# Altium schematic sheet Nam_Sheet2.SchDoc
size A4; Organization: Altium Limited; Address1: L3, 12a Rodborough Rd; Address2: Frenchs Forest; Address3: NSW; Address4: Australia 2086
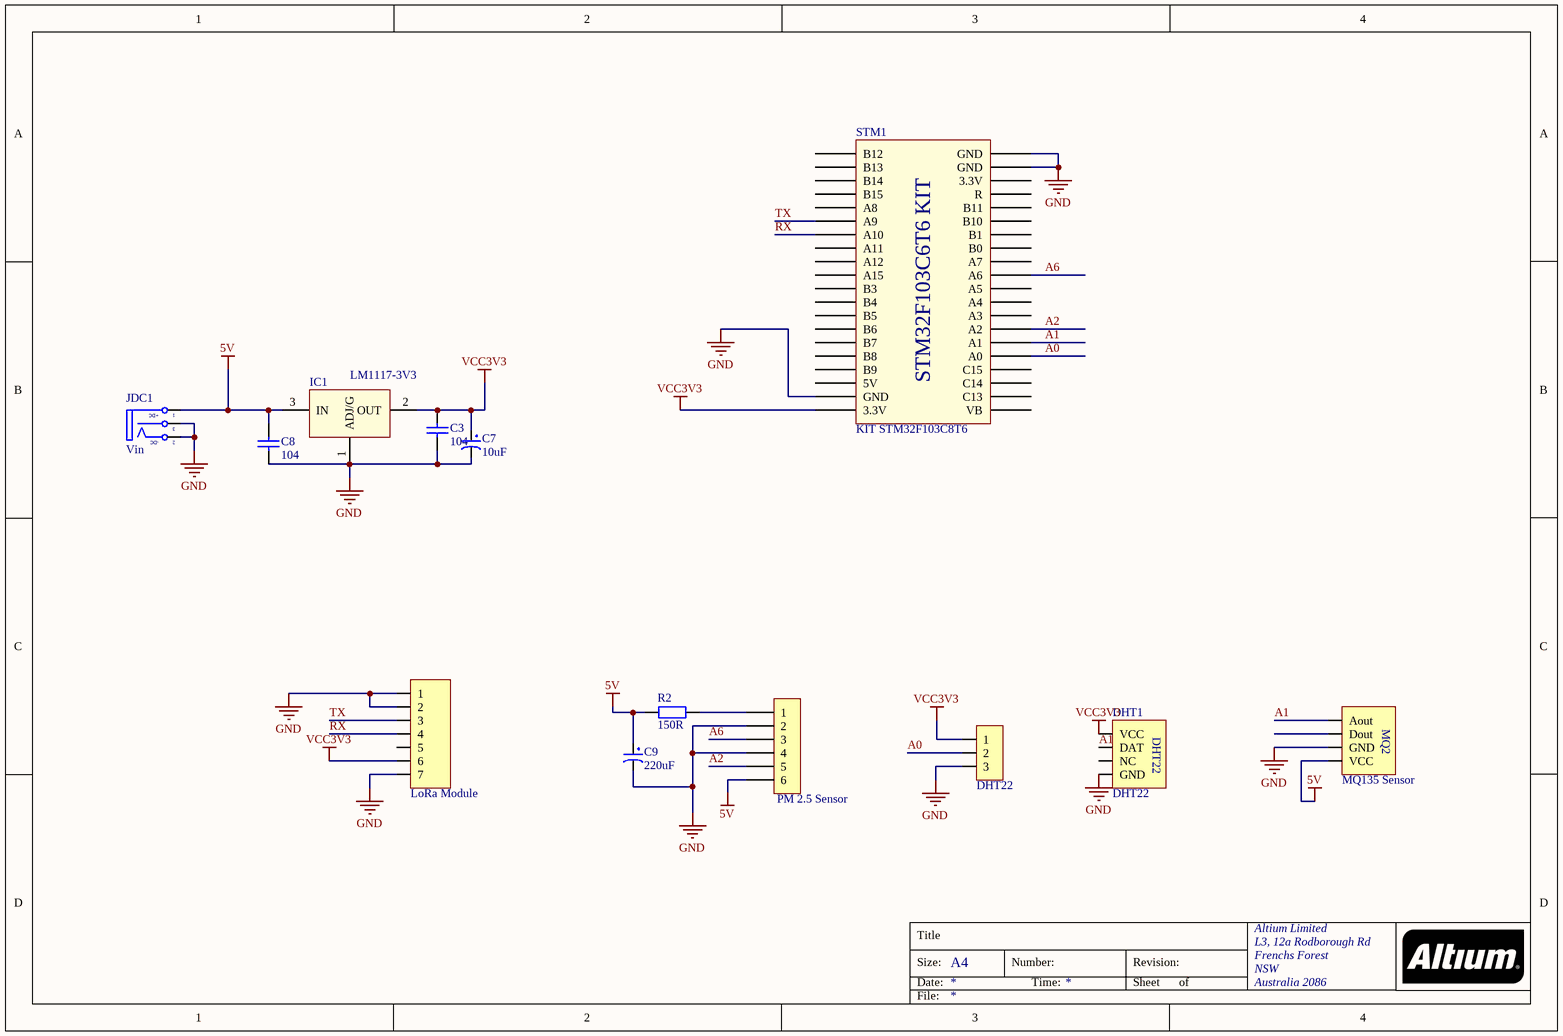
[diagram p0: Nam_Sheet2.SchDoc]

## Parts
C3  104  [tu gom]
C7  10uF  [Tu hoa 8mm]
C8  104  [tu gom]
C9  220uF  [Tu hoa 8mm]
DHT1  DHT22  [DHT22]
DHT22  DHT22  [JP 1x3 CT]
H2  PM 2.5 Sensor  [XH2.54M-6]
IC1  LM1117-3V3  [SOT223-4N]
JDC1  Vin  [DC-IN]
LoRa_Module  LoRa Module  [JP 1x7 CT]
MQ135_Sensor  MQ135 Sensor  [MQ2-MODULE]
R2  150R  [tro vach 1/4w]
STM1  KIT STM32F103C8T6  [STM32F103 KIT]

## Nets
5V: C8.2 C9.1 H2.6 IC1.3(IN) JDC1.1(T) MQ135_Sensor.4(VCC) R2.1
GND: C3.1 C7.2 C8.1 C9.2 DHT1.4(GND) DHT22.3 H2.2 H2.4 IC1.1(ADJ/G) JDC1.2(TN) JDC1.3(S) LoRa_Module.1 LoRa_Module.2 LoRa_Module.7 MQ135_Sensor.3(GND) STM1.19(GND) STM1.39(GND) STM1.40(GND)
VCC3V3: C3.2 C7.1 DHT1.1(VCC) DHT22.1 IC1.2(OUT) LoRa_Module.6 STM1.20(3.3V)
A0: DHT22.2 STM1.25(A0)
A1: DHT1.2(DAT) MQ135_Sensor.1(Aout) STM1.26(A1)
A2: H2.5 STM1.27(A2)
A6: H2.3 STM1.31(A6)
RX: LoRa_Module.4 STM1.7(A10)
TX: LoRa_Module.3 STM1.6(A9)
NetH2_1: H2.1 R2.2

Not connected (* = marked no-connect by the designer): DHT1 3(NC); LoRa_Module 5; MQ135_Sensor 2(Dout); STM1 1(B12) 2(B13) 3(B14) 4(B15) 5(A8) 8(A11) 9(A12) 10(A15) 11(B3) 12(B4) 13(B5) 14(B6) 15(B7) 16(B8) 17(B9) 18(5V) 21(VB) 22(C13) 23(C14) 24(C15) 28(A3) 29(A4) 30(A5) 32(A7) 33(B0) 34(B1) 35(B10) 36(B11) 37(R) 38(3.3V)

## Notes on the sheet
- Title
- Size:
- Date:
- A4
- Number:
- Time:
- Revision:
- Sheet
- of
- File:
- (in symbol DCIN) +DC; -DC
- (in symbol MQ2-MOD) MQ2
- (in symbol STM32f103 Bluepill) STM32F103C6T6 KIT

## Library data of the parts
C3 C8 = Tu gom 104 50V: Cắm; So_Chan: 2; Ten_Linh_Kien: Tụ gốm 104 100nF 50V; Don_Vi: Con; Ma_Hang: MH004761; Chung_Loai: Cắm; Kieu_Chan: *
C7 C9 = Tu Hoa 220uF 25V 8x10: Cắm; Don_Vi: Con; So_Chan: 2; Ten_Linh_Kien: Tụ Hóa 220uF 25V 8x10MM; Ma_Hang: MH006864; Chung_Loai: Cắm; Kieu_Chan: *
DHT1 = DHT22: Manufacturer: W¨¹rth Elektronik eiSos GmbH; partNo: 613004143121; ComponentLink1 Description: Manufacturer; ComponentLink2 Description: Datasheet; NoPins: 04; Created Date: 29 March 2013; ComponentLink1URL: http://www.we-online.com; ComponentLink2URL: http://katalog.we-online.de/em/datasheet/6130xx143121.pdf; Created by: Karrer Zheng
DHT22 = JP 1x3 2.54 Cai Thang: Cắm; Ten_Linh_Kien: Jump Đơn Cái 2.54MM 1x20P Thẳng; Don_Vi: Con; Ma_Hang: MH004006; Ghi_Chu: *; Kieu_Chan: *; Chung_Loai: Cắm
H2 = Header 6P 2.54 Duc Thang: Cắm; Ten_Linh_Kien: Header 6P XH2.54-6P Đực Thẳng; Don_Vi: Con; Ma_Hang: MH001972; Chung_Loai: Cắm
IC1 = LM1117: Available in 1.8V, 2.5V, 2.85V, 3.3V, 5V, and  Adjustable Versions; Value: LM317
JDC1 = DCIN: Jac DC input; Value: Jac DC
LoRa_Module = JP 1x7 2.54 Cai Thang: Cắm; Ten_Linh_Kien: Jump Đơn Cái 2.54MM 1x20P Thẳng; Don_Vi: Con; Ma_Hang: MH004006; Ghi_Chu: *; Kieu_Chan: *; Chung_Loai: Cắm
MQ135_Sensor = MQ2-MOD: Manufacturer: W¨¹rth Elektronik eiSos GmbH; partNo: 613004143121; ComponentLink1 Description: Manufacturer; ComponentLink2 Description: Datasheet; NoPins: 04; Created Date: 29 March 2013; ComponentLink1URL: http://www.we-online.com; ComponentLink2URL: http://katalog.we-online.de/em/datasheet/6130xx143121.pdf; Created by: Karrer Zheng
R2 = Tro Vach 1/4W 5% 510R: Cắm; So_Chan: 2; Don_Vi: Con; Ten_Linh_Kien: Trở Vạch 1/4w 5% 510R; Ma_Hang: MH007325; Chung_Loai: Cắm; Kieu_Chan: *
STM1 = STM32f103 Bluepill: KIT STM32F103C8T6 Bluepill